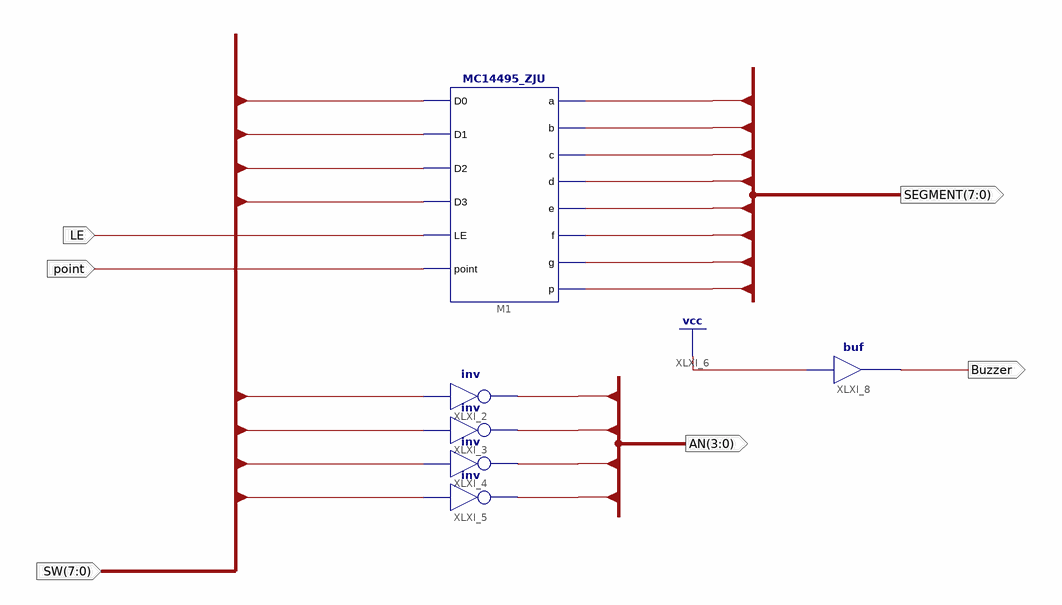
[diagram p0: schematic sheet 1]
// Xilinx ISE schematic Hex27Seg_sch.sch (kintex7) as structural Verilog: 6 symbols, 6 ports
module Hex27Seg_sch (
  input  [7:0] SW,
  input  LE,
  input  point,
  output [3:0] AN,
  output Buzzer,
  output [7:0] SEGMENT
);

  MC14495_ZJU M1 (
    .D0(SW[0]), .D1(SW[1]), .D2(SW[2]), .D3(SW[3]), .LE(LE), .point(point), .a(SEGMENT[0]), .b(SEGMENT[1]),
    .c(SEGMENT[2]), .d(SEGMENT[3]), .e(SEGMENT[4]), .f(SEGMENT[5]), .g(SEGMENT[6]), .p(SEGMENT[7]));
  not XLXI_2 (AN[0], SW[4]);
  not XLXI_3 (AN[1], SW[5]);
  not XLXI_4 (AN[2], SW[6]);
  not XLXI_5 (AN[3], SW[7]);
  buf XLXI_8 (Buzzer, 1'b1);
endmodule
